# Altium schematic sheet SHDN-BSPD-S12-V00-Connectivity.SchDoc: 8 Pin Connector
size A3; DrawnBy: Jonn Dillon; DocumentNumber: 12; Revision: 01; SheetNumber: 12; SheetTotal: 12
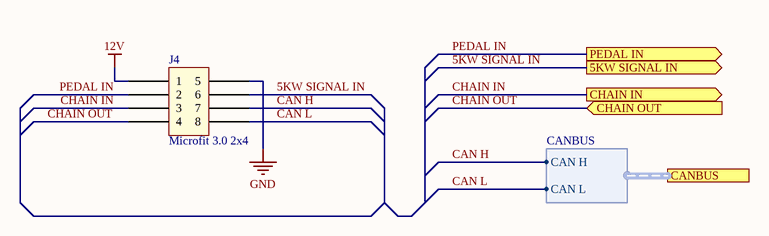
[diagram p0: SHDN-BSPD-S12-V00-Connectivity.SchDoc]

## Parts
J4  Microfit 3.0 2x4  [Microfit_2X4_R_TH]

## Ports
5KW SIGNAL IN (out), CANBUS (harness CANBUS), CHAIN IN (out), CHAIN OUT (in), PEDAL IN (out)

## Harnesses
CANBUS: CAN H, CAN L

## Nets
12V: J4.1
GND: J4.5
5KW SIGNAL IN: J4.6 ; port 5KW SIGNAL IN
CAN H: J4.7 ; port CANBUS.CAN H
CAN L: J4.8 ; port CANBUS.CAN L
CHAIN IN: J4.3 ; port CHAIN IN
CHAIN OUT: J4.4 ; port CHAIN OUT
PEDAL IN: J4.2 ; port PEDAL IN

## Notes on the sheet
- Revision History:
- Sheet Title:
- Rev
- Date
- Description
- Project:
- Size:
- Drawn By:
- A3
- Number:
- Revision:
- Sheet
- Version:
- of
- QUT Motorsport
- O-120, Gardens Point
- 2 George Street
- Brisbane, QLD 4000
- Australia
- Print Date:
- Print Time:
- File Name:

## Library data of the parts
J4 = Microfit_2x4